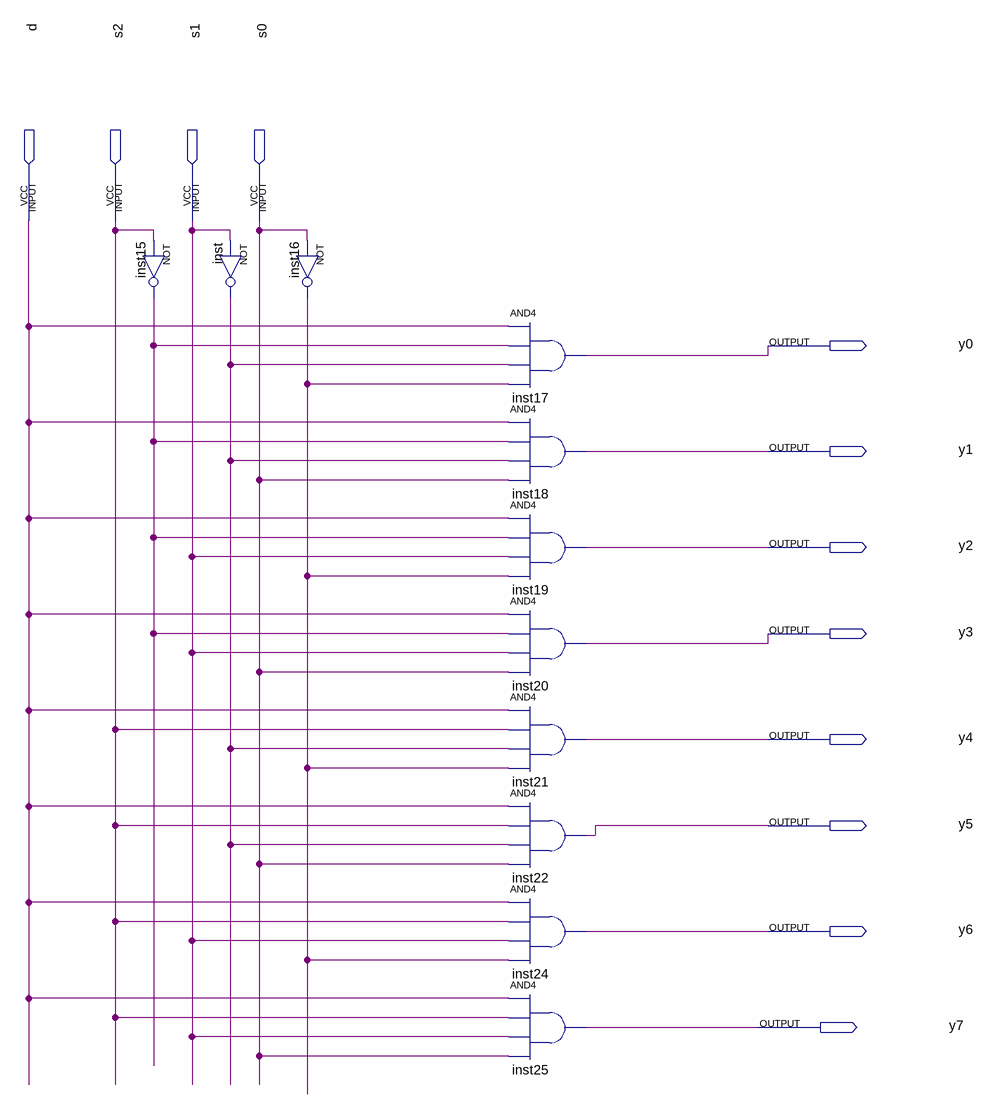
[diagram p0: schematic sheet]
// Quartus schematic zadania_3.bdf as structural Verilog: 11 symbols, 12 pins
module zadania_3 (
  input  d,
  input  s2,
  input  s1,
  input  s0,
  output y0,
  output y1,
  output y2,
  output y3,
  output y4,
  output y5,
  output y6,
  output y7
);

  wire inst15_out, inst16_out, inst_out;

  not inst15 (inst15_out, s2);
  not inst (inst_out, s1);
  not inst16 (inst16_out, s0);
  and inst17 (y0, d, inst15_out, inst_out, inst16_out);
  and inst18 (y1, d, inst15_out, inst_out, s0);
  and inst19 (y2, d, inst15_out, s1, inst16_out);
  and inst20 (y3, d, inst15_out, s1, s0);
  and inst21 (y4, d, s2, inst_out, inst16_out);
  and inst22 (y5, d, s2, inst_out, s0);
  and inst24 (y6, d, s2, s1, inst16_out);
  and inst25 (y7, d, s2, s1, s0);
endmodule
